# EAGLE design ReDevelo_rev_B (EAGLE 9.6.2)
PC Engine Joypad Breakout Version 1.0
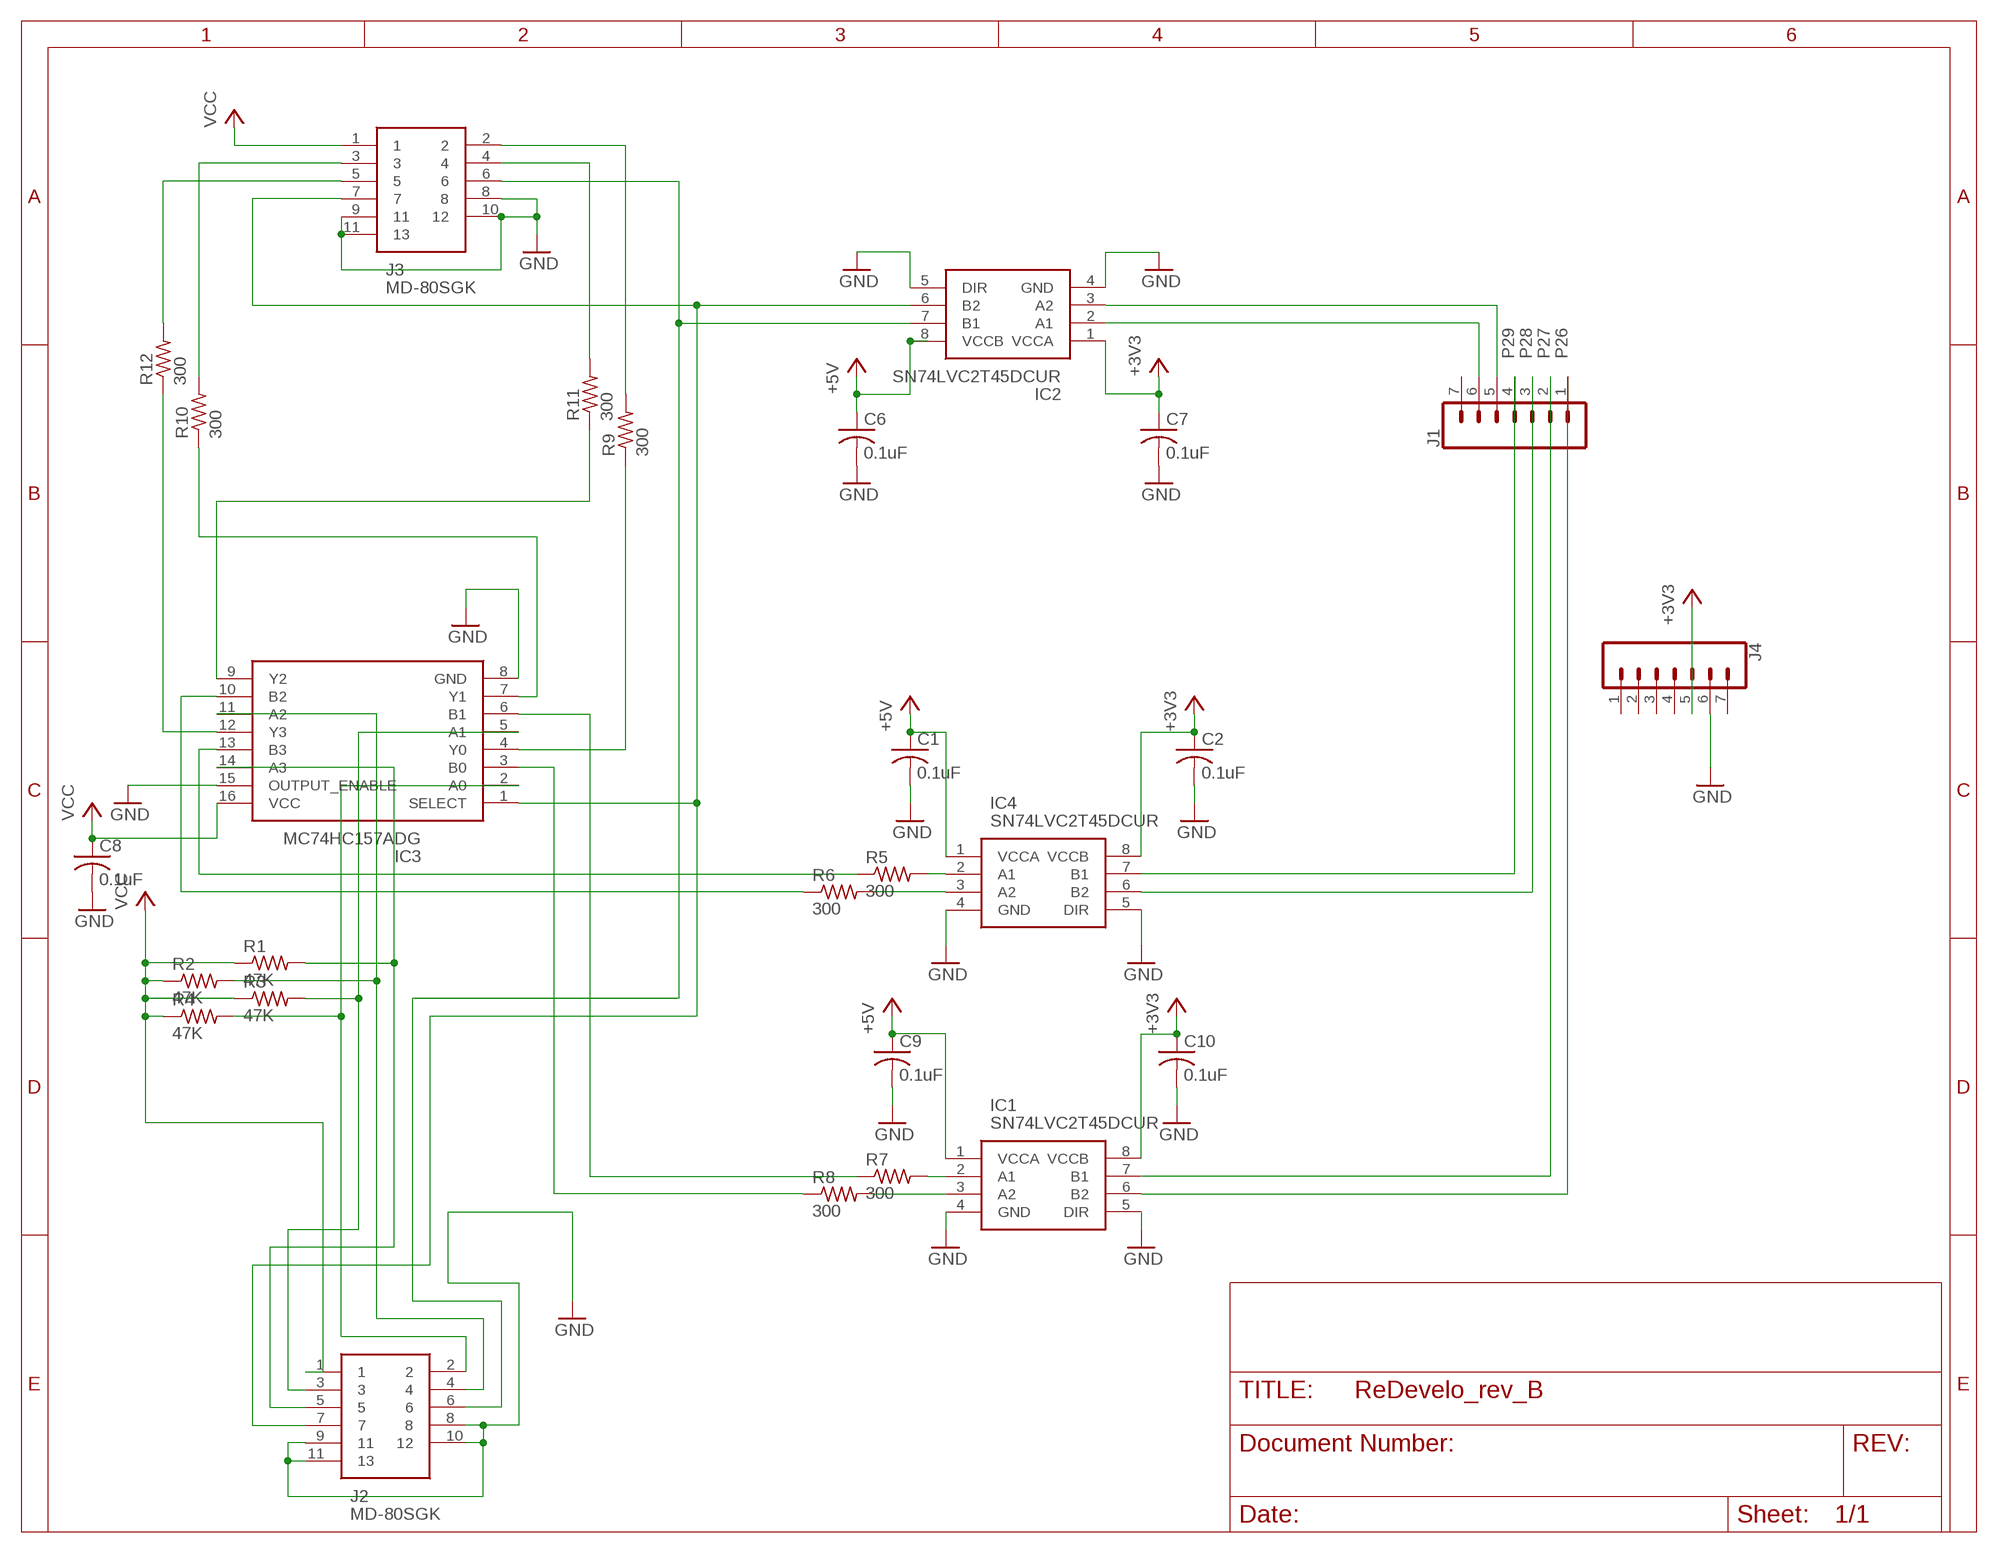
[diagram p0: schematic, sheet 1]

## Parts
C1  0.1uF  C-USC0402  [C0402]
C2  0.1uF  C-USC0402  [C0402]
C6  0.1uF  C-USC0402  [C0402]
C7  0.1uF  C-USC0402  [C0402]
C8  0.1uF  C-USC0402  [C0402]
C9  0.1uF  C-USC0402  [C0402]
C10  0.1uF  C-USC0402  [C0402]
IC1  SN74LVC2T45DCUR  [SOP50P310X90-8N]
IC2  SN74LVC2T45DCUR  [SOP50P310X90-8N]
IC3  MC74HC157ADG  [SOIC127P600X175-16N]
IC4  SN74LVC2T45DCUR  [SOP50P310X90-8N]
J1  CONN_071X07_LONGPADS_OFFSET  [1X07_LONGPADS_OFFSET]
J2  MD-80SGK  [MD80SGK]
J3  MD-80SGK  [MD80SGK]
J4  CONN_071X07_LONGPADS_OFFSET  [1X07_LONGPADS_OFFSET]
R1  47K  R-US_R0402  [R0402]
R2  47K  R-US_R0402  [R0402]
R3  47K  R-US_R0402  [R0402]
R4  47K  R-US_R0402  [R0402]
R5  300  R-US_R0402  [R0402]
R6  300  R-US_R0402  [R0402]
R7  300  R-US_R0402  [R0402]
R8  300  R-US_R0402  [R0402]
R9  300  R-US_R0402  [R0402]
R10  300  R-US_R0402  [R0402]
R11  300  R-US_R0402  [R0402]
R12  300  R-US_R0402  [R0402]

## Nets
+3V3 [power]: C2.1 C7.1 C10.1 IC1.8(VCCB) IC2.1(VCCA) IC4.8(VCCB) J4.5
CLR [signal]: IC2.6(B2) IC3.1(SELECT) J2.7 J3.7
D12: IC2.2(A1) J1.6
D13 [signal]: IC2.3(A2) J1.5
GND: C1.2 C2.2 C6.2 C7.2 C8.2 C9.2 C10.2 IC1.4(GND) IC1.5(DIR) IC2.4(GND) IC2.5(DIR) IC3.8(GND) IC3.15(OUTPUT_ENABLE) IC4.4(GND) IC4.5(DIR) J2.8 J2.9 J2.10 J2.11 J3.8 J3.9 J3.10 J3.11 J4.6
N$2 [signal]: IC3.5(A1) J2.3 R3.2
N$3 [signal]: IC3.2(A0) J2.2 R4.2
N$4 [signal]: IC3.11(A2) J2.4 R2.2
N$5 [signal]: IC3.14(A3) J2.5 R1.2
N$8: IC3.12(Y3) R12.1
N$9: IC3.9(Y2) R11.1
N$10: IC3.13(B3) R5.1
N$11: IC3.7(Y1) R10.1
N$12: IC4.2(A1) R5.2
N$13: IC4.3(A2) R6.2
N$14: IC1.3(A2) R8.2
N$15: IC1.2(A1) R7.2
N$16: IC3.10(B2) R6.1
N$17: IC3.3(B0) R8.1
N$18: IC3.6(B1) R7.1
N$19: J3.2 R9.2
N$20: J3.4 R11.2
N$22: IC3.4(Y0) R9.1
N$23: J3.3 R10.2
N$24: J3.5 R12.2
P26 [signal]: IC1.6(B2) J1.1
P27: IC1.7(B1) J1.2
P28 [signal]: IC4.6(B2) J1.3
P29 [signal]: IC4.7(B1) J1.4
SEL [signal]: IC2.7(B1) J2.6 J3.6
VCC [power]: C1.1 C6.1 C8.1 C9.1 IC1.1(VCCA) IC2.8(VCCB) IC3.16(VCC) IC4.1(VCCA) J2.1 J3.1 R1.1 R2.1 R3.1 R4.1 ; supply symbol labelled +5V
Unconnected: J1.7 J4.1 J4.2 J4.3 J4.4 J4.7

## Library data of the parts
C1 C2 C6-C10 = PC-Engine0402:C-US: CAPACITOR, American symbol
IC1 IC2 IC4 = PC-Engine:SN74LVC2T45DCUR: Texas Instruments SN74LVC2T45DCUR, Voltage Level Translator, Bus Transceiver, 3-State, 1.65 5.5 V, 8-Pin UM Source: Datasheet <http://www.ti.com/lit/gpn/sn74lvc2t45>; ARROW_PART_NUMBER: SN74LVC2T45DCUR; ARROW_PRICE-STOCK: https://www.arrow.com/en/products/sn74lvc2t45dcur/texas-instruments?region=nac; DESCRIPTION: Texas Instruments SN74LVC2T45DCUR, Voltage Level Translator, Bus Transceiver, 3-State, 1.65 5.5 V, 8-Pin UM; HEIGHT: 0.9mm; MANUFACTURER_NAME: Texas Instruments; MANUFACTURER_PART_NUMBER: SN74LVC2T45DCUR; MOUSER_PART_NUMBER: 595-SN74LVC2T45DCUR; MOUSER_PRICE-STOCK: https://www.mouser.co.uk/ProductDetail/Texas-Instruments/SN74LVC2T45DCUR?qs=0smPjiIwnfIdG9vxyJHBdA%3D%3D
IC3 = PC-Engine:MC74HC157ADG: Source: Datasheet <http://www.onsemi.com/pub/Collateral/MC74HC157A-D.PDF>; ALLIED_NUMBER: 70466365; ALLIED_PRICE-STOCK: http://www.alliedelec.com/on-semiconductor-mc74hc157adg/70466365/; HEIGHT: 1.75mm; MANUFACTURER_NAME: ON Semiconductor; MANUFACTURER_PART_NUMBER: MC74HC157ADG; MOUSER_PART_NUMBER: 863-MC74HC157ADG; MOUSER_PRICE-STOCK: https://www.mouser.com/Search/Refine.aspx?Keyword=863-MC74HC157ADG; RS_PART_NUMBER: 8061422P; RS_PRICE-STOCK: http://uk.rs-online.com/web/p/products/8061422P
J1 J4 = SparkFun-Connectors_new:CONN_07: Multi connection point. Often used as Generic Header-pin footprint for 0.1 inch spaced/style header connections On any of the 0.1 inch spaced packages, you can populate with these: Break Away Headers - Straight <https://www.sparkfun.com/products/116> (PRT-00116) Break Away Male Headers - Right Angle <https://www.sparkfun.com/products/553> (PRT-00553) Female Headers <https://www.sparkfun.com/products/115> (PRT-00115) Break Away Headers - Machine Pin <https://www.sparkfun.com/products/117> (PRT-00117) Break Away Female Headers - Swiss Machine Pin <https://www.sparkfun.com/products/743> (PRT-00743) For SCREWTERMINALS and SPRING TERMINALS visit here: Screw Terimnals on SparkFun.com <https://www.sparkfun.com/search/results?term=Screw+Terminals> (5mm/3.5mm/2.54mm spacing) This device is also useful as a general connection point to wire up your design to another part of your project. Our various solder wires solder well into these plated through hole pads. Hook-Up Wire - Assortment (Stranded, 22 AWG) <https://www.sparkfun.com/products/11375> (PRT-11375) Hook-Up Wire - Assortment (Solid Core, 22 AWG) <https://www.sparkfun.com/products/11367> (PRT-11367) View the entire wire category on our website here <https://www.sparkfun.com/categories/141> Special notes: Molex polarized connector foot print use with SKU : PRT-08231 with associated crimp pins and housings. 1MM SMD Version SKU: PRT-10208 NOTES ON THE VARIANTS LOCK and LOCK_LONGPADS... This footprint was designed to help hold the alignment of a through-hole component (i.e. 6-pin header) while soldering it into place. You may notice that each hole has been shifted either up or down by 0.005 of an inch from it's more standard position (which is a perfectly straight line). This slight alteration caused the pins (the squares in the middle) to touch the edges of the holes. Because they are alternating, it causes a "brace" to hold the component in place. 0.005 has proven to be the perfect amount of "off-center" position when using our standard breakaway headers. Although looks a little odd when you look at the bare footprint, once you have a header in there, the alteration is very hard to notice. Also,if you push a header all the way into place, it is covered up entirely on the bottom side.
J2 J3 = SamacSys_Parts:MD-80SGK: Circular DIN Connectors mini-DIN, 8P jack, rt, through hole, full shield Source: Datasheet <https://www.cui.com/product/resource/md-sgk-series.pdf>; DESCRIPTION: Circular DIN Connectors mini-DIN, 8P jack, rt, through hole, full shield; HEIGHT: 13mm; MANUFACTURER_NAME: CUI; MANUFACTURER_PART_NUMBER: MD-80SGK; MOUSER_PART_NUMBER: 490-MD-80SGK; MOUSER_PRICE-STOCK: https://www.mouser.com/Search/Refine.aspx?Keyword=490-MD-80SGK
R1-R12 = PC-Engine0402:R-US_: RESISTOR, American symbol

## Net classes
0 default: width 0.152 mm, drill 0.356 mm, clearance 0.152 mm
1 power: width 0.305 mm, drill 0.356 mm, clearance 0.152 mm
2 signal: width 0.152 mm, drill 0.356 mm, clearance 0.152 mm

## Board
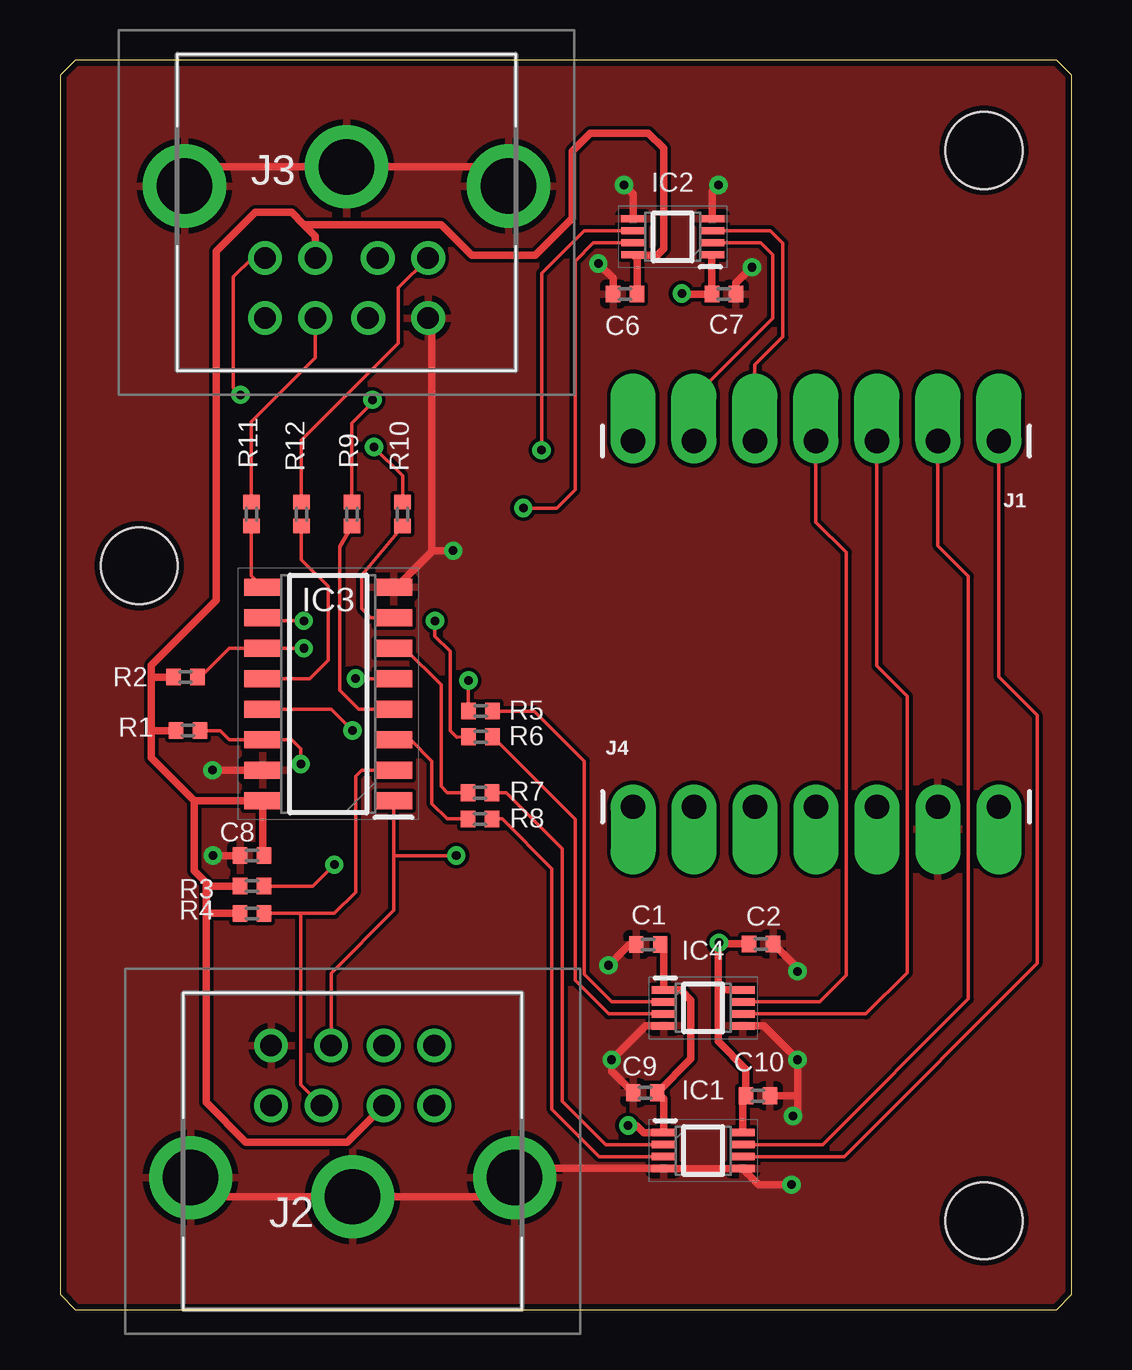
[diagram p1: board, top side]
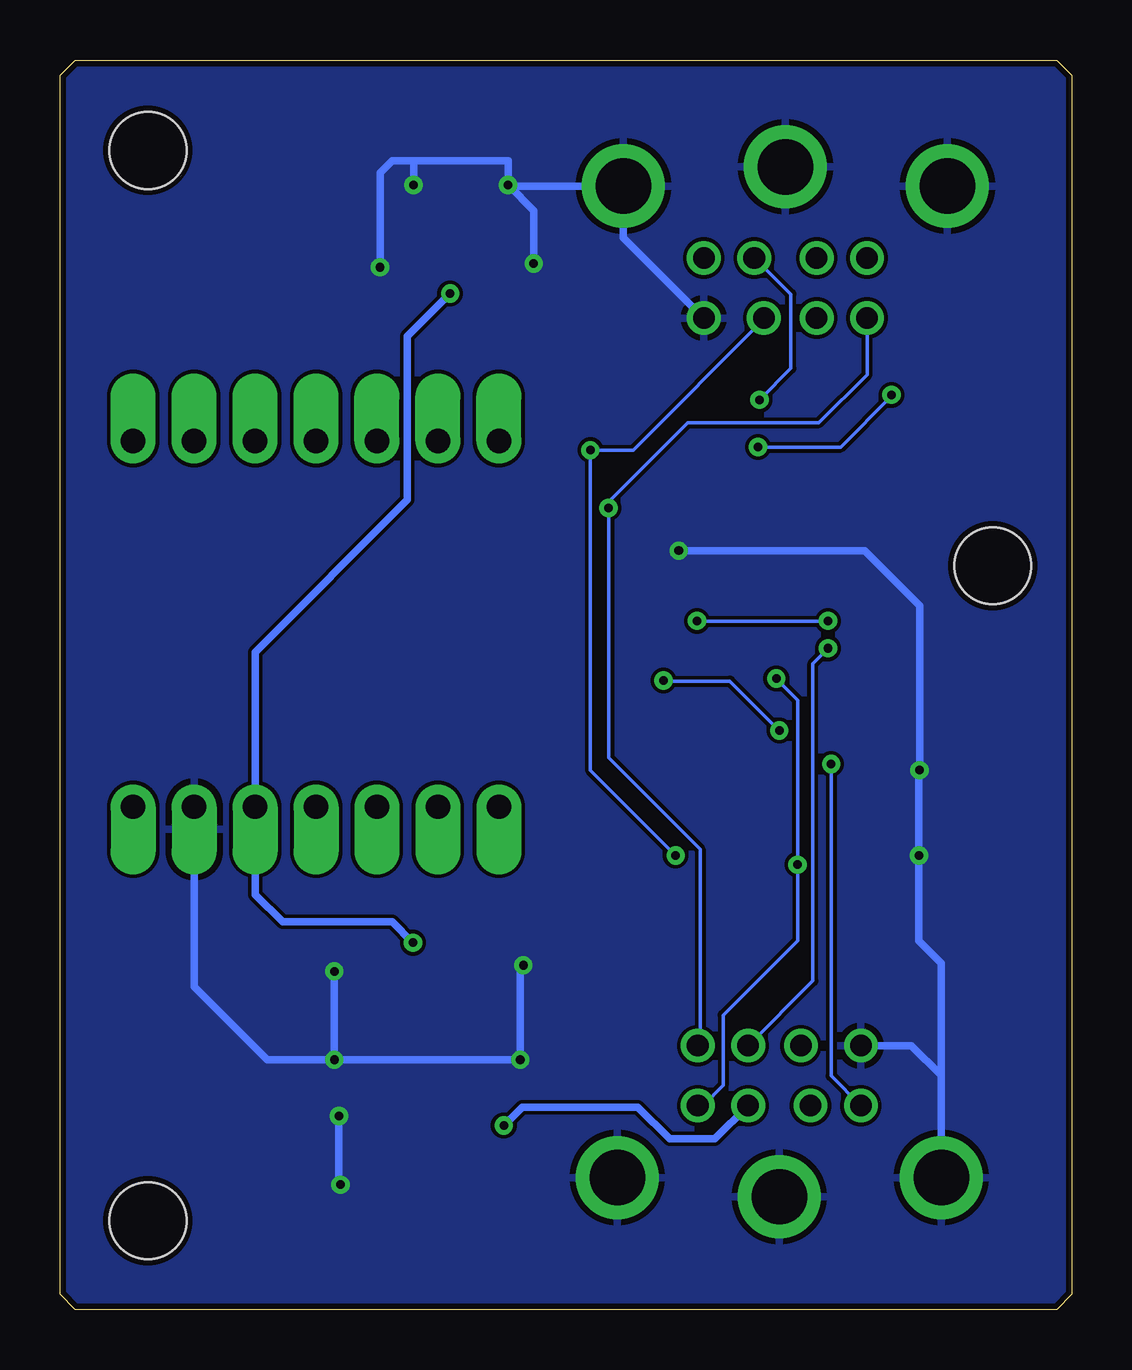
[diagram p2: board, bottom side, seen from below]

Size 42.16 x 52.07 mm. Coordinates in mm from the lower left corner, seen from the top.
Outline: 0.64,0 41.53,0 42.16,0.64 42.16,51.44 41.53,52.07 0.64,52.07 0,51.44 0,0.64 0.64,0
Copper layers (1*16): Top 0.035mm / dielectric 1.5mm / Bottom 0.035mm
Design rules "default *": minimum track width 6mil, minimum drill 0.35mm, track to track 6mil, track to pad 6mil, pad to pad 6mil, via to via 6mil, smd to smd 6mil, copper to edge 10mil, drill to drill 6mil, minimum pad ring 10mil, minimum via ring 8mil, stop-mask expansion 6mil, vias tented up to drill 15mil, thermal gap 10mil
Holes 3.2 mm at 3.3,31 38.5,48.3 38.5,3.7

### Footprints (pad centres in the part's own frame; a part is rotated, then mirrored left to right if it is on the bottom)
C0402 = smd 0.6 x 0.7: 1 -0.5,0; 2 0.5,0
SOP50P310X90-8N = smd 1 x 0.3: 1 -1.65,0.75; 2 -1.65,0.25; 3 -1.65,-0.25; 4 -1.65,-0.75; 5 1.65,-0.75; 6 1.65,-0.25; 7 1.65,0.25; 8 1.65,0.75
SOIC127P600X175-16N = smd 1.55 x 0.7: 1 -2.725,4.445; 2 -2.725,3.175; 3 -2.725,1.905; 4 -2.725,0.635; 5 -2.725,-0.635; 6 -2.725,-1.905; 7 -2.725,-3.175; 8 -2.725,-4.445; 9 2.725,-4.445; 10 2.725,-3.175; 11 2.725,-1.905; 12 2.725,-0.635; 13 2.725,0.635; 14 2.725,1.905; 15 2.725,3.175; 16 2.725,4.445
1X07_LONGPADS_OFFSET = drill 1.016 pad 1.88 offset: 1 0,0; 2 2.54,0; 3 5.08,0; 4 7.62,0; 5 10.16,0; 6 12.7,0; 7 15.24,0
MD80SGK = drill 0.9 pad 1.4: 1 -1.3,-1.9; 2 1.3,-1.9; 3 -3.4,-1.9; 4 -1.3,-4.4; 5 3.4,-1.9; 6 -3.4,-4.4; 7 0.9,-4.4; 8 3.4,-4.4 | drill 2.309 pad 3.463: 9 0,1.9; 10 -6.75,1.1; 11 6.75,1.1
R0402 = smd 0.6 x 0.7: 1 -0.5,0; 2 0.5,0

### Placement (x,y rotation side)
C1  24.51,15.21 180 top
C2  29.21,15.24 0 top
C6  23.55,42.32 180 top
C7  27.66,42.32 0 top
C8  8,18.92 180 top
C9  24.38,9.04 180 top
C10  29.08,8.92 0 top
IC1  26.8,6.63 0 top
IC2  25.53,44.7 180 top
IC3  11.18,25.65 180 top
IC4  26.8,12.57 0 top
J1  39.12,36.2 180 top
J2  12.19,6.6 180 top
J3  11.94,45.72 0 top
J4  23.88,20.95 0 top
R1  5.33,24.13 0 top
R2  5.23,26.36 0 top
R3  8,17.65 0 top
R4  8,16.51 0 top
R5  17.53,24.94 0 top
R6  17.53,23.88 0 top
R7  17.5,21.54 0 top
R8  17.5,20.45 0 top
R9  12.17,33.15 90 top
R10  14.27,33.15 90 top
R11  7.98,33.15 90 top
R12  10.06,33.15 90 top

### Tracks (layer width: path | path; a pad name or v marks a point on that pad's centre or on a via)
+3V3  (via drill 0.36)
  Top 0.305: 27.43,13.34 27.43,11.18 28.58,10.03 C10.1 28.45,8.78 IC1.8 | 27.43,13.34 28.43,13.34 IC4.8 | 27.43,13.34 27.43,15.27 v27.46,15.29 27.51,15.24 C2.1 | IC2.1 27.16,43.94 C7.1 25.93,42.32 v25.91,42.34
  Bottom 0.305: v27.46,15.29 28.32,16.15 32.89,16.15 34.04,17.3 J4.5 34.04,27.4 27.69,33.75 27.69,40.56 v25.91,42.34
CLR  (via drill 0.36)
  Top 0.152: v20.07,35.81 20.07,43.18 21.84,44.95 IC2.6 | J2.7 11.29,14.03 13.9,16.64 13.9,18.92 | 13.9,18.92 IC3.1 | v16.51,18.92 13.9,18.92
  Bottom 0.152: J3.7 12.84,41.26 18.29,35.81 v20.07,35.81 20.07,22.48 v16.51,18.92
D12
  Top 0.152: IC2.2 29.21,44.45 29.7,43.95 29.7,41.31 26.42,38.02 J1.6
D13
  Top 0.152: IC2.3 29.59,44.96 30.12,44.42 30.12,40.54 28.96,39.37 J1.5
GND  (via drill 0.36)
  Top 0.305: J2.11 6.24,4.7 J2.9 18.14,4.7 J2.10 19.32,5.88 IC1.4 IC1.5 29.12,5.21 v30.48,5.21 | J3.10 5.99,47.62 J3.9 17.89,47.62 J3.11 | IC3.8 14.02,30.1 15.49,31.57 | J3.8 15.49,41.17 15.49,31.57 | v23.5,46.86 23.88,46.48 IC2.5 | IC2.4 27.18,46.61 v27.43,46.86 | IC4.5 29.32,11.82 v30.73,10.41 30.73,8.81 | IC4.4 24.4,11.82 v22.99,10.41 22.99,9.94 C9.2 | v6.38,18.92 C8.2 | v6.35,22.48 IC3.15 | 30.73,8.81 30.73,8.26 v30.54,8.06 | C10.2 30.63,8.91 30.73,8.81 | C2.2 30.73,14.22 v30.73,14.1 | v22.86,14.35 23.72,15.21 C1.2 | C7.2 28.16,42.77 v28.83,43.43 | v22.43,43.59 23.05,42.97 C6.2 | v16.38,31.62 15.54,31.62 15.49,31.57
  Bottom 0.305: J3.8 18.69,44.67 J3.11 23.45,46.82 v23.5,46.86 | 27.43,47.88 23.5,47.88 v23.5,46.86 | 27.43,47.88 28.32,47.88 28.83,47.37 v28.83,43.43 | 27.43,47.88 v27.43,46.86 | v30.73,14.1 v30.73,10.41 | v30.54,8.06 30.54,5.27 v30.48,5.21 | v22.86,14.35 22.99,14.22 v22.99,10.41 v30.73,10.41 | J2.8 6.69,11 5.44,9.76 | J2.11 5.44,9.76 | 5.44,9.76 5.44,14.43 6.38,15.37 v6.38,18.92 6.38,22.45 v6.35,22.48 6.35,29.34 8.64,31.62 v16.38,31.62 | v23.5,46.86 22.43,45.8 v22.43,43.59 | v30.73,10.41 33.53,10.41 36.58,13.46 J4.6
  pour Bottom: -0.38,52.83 43.05,52.83 43.05,-0.38 -0.38,-0.38
  pour Top: -1.02,-0.25 -1.02,53.09 43.56,53.09 43.56,-0.51 -0.76,-0.51
N$2  (via drill 0.36)
  Top 0.152: R3.2 10.54,17.65 v11.43,18.54 | v12.32,26.3 12.33,26.29 IC3.5
  Bottom 0.152: J2.3 15.37,8.5 14.53,9.35 14.53,12.27 11.43,15.37 v11.43,18.54 11.43,25.4 v12.32,26.29 v12.32,26.3
N$3
  Top 0.152: J2.2 10.03,9.36 10.03,16.51 | IC3.2 12.58,22.48 12.32,22.22 12.32,17.4 11.43,16.51 11.05,16.51 10.03,16.51 | R4.2 10.03,16.51
N$4  (via drill 0.36)
  Top 0.152: R2.2 5.85,26.36 7.05,27.56 IC3.11 v10.16,27.56
  Bottom 0.152: J2.4 10.79,13.7 10.79,26.92 v10.16,27.56
N$5  (via drill 0.36)
  Top 0.152: R1.2 6.67,24.13 7.05,23.75 IC3.14 9.65,23.75 10.03,23.37 v10.03,22.73
  Bottom 0.152: J2.5 10.03,9.74 v10.03,22.73
N$8
  Top 0.152: IC3.12 10.41,26.29 11.18,27.05 11.18,30.14 10.06,31.26 R12.1
N$9
  Top 0.152: IC3.9 7.98,30.57 R11.1
N$10  (via drill 0.36)
  Top 0.152: IC3.13 11.3,25.02 v12.19,24.13 | R5.1 17.02,24.95 v17.02,26.21
  Bottom 0.152: v12.19,24.13 14.25,26.19 16.99,26.19 v17.02,26.21
N$11
  Top 0.152: IC3.7 12.95,28.83 12.57,29.21 12.57,30.59 R10.1
N$12
  Top 0.152: R5.2 19.76,24.94 21.84,22.86 21.84,13.97 22.99,12.82 IC4.2
N$13
  Top 0.152: R6.2 21.46,20.44 21.46,13.72 22.86,12.32 IC4.3
N$14
  Top 0.152: IC1.3 22.48,6.38 20.5,8.36 20.5,18.38 18.43,20.45 R8.2
N$15
  Top 0.152: IC1.2 22.74,6.88 20.93,8.69 20.93,19.2 18.59,21.54 R7.2
N$16  (via drill 0.36)
  Top 0.152: v15.62,28.7 15.62,28.07 16.26,27.43 16.26,24.13 16.54,23.85 R6.1 | v10.16,28.7 8.58,28.7 IC3.10
  Bottom 0.152: v15.62,28.7 15.6,28.68 10.19,28.68 v10.16,28.7
N$17
  Top 0.152: IC3.3 14.61,23.75 15.49,22.86 15.49,21.08 16.13,20.45 R8.1
N$18
  Top 0.152: R7.1 16.14,21.54 15.88,21.8 15.88,26.04 14.35,27.56 IC3.6
N$19  (via drill 0.36)
  Top 0.152: R9.2 12.17,36.93 13.08,37.85 v13.02,37.91
  Bottom 0.152: v13.02,37.91 11.71,39.22 11.71,42.32 13.21,43.82 J3.2
N$20
  Top 0.152: R11.2 7.98,36.99 10.64,39.66 J3.4
N$22
  Top 0.152: R9.1 11.66,31.79 11.66,25.81 12.45,25.02 IC3.4
N$23  (via drill 0.36)
  Top 0.152: J3.3 8.01,43.82 7.22,43.04 7.22,38.42 v7.52,38.12 | R10.2 14.28,34.75 v13.08,35.94
  Bottom 0.152: v13.08,35.94 9.64,35.94 7.52,38.06 v7.52,38.12
N$24
  Top 0.152: J3.5 14.1,42.58 14.1,40.26 10.06,36.22 R12.2
P26
  Top 0.152: IC1.6 32.67,6.38 40.72,14.43 40.72,24.77 39.12,26.37 J1.1
P27
  Top 0.152: IC1.7 31.77,6.88 37.85,12.95 37.85,30.56 36.58,31.83 J1.2
P28
  Top 0.152: J1.3 34.04,26.82 35.31,25.55 35.31,14.05 33.58,12.32 IC4.6
P29
  Top 0.152: IC4.7 31.65,12.82 32.76,13.94 32.76,31.55 31.5,32.82 J1.4
SEL  (via drill 0.36)
  Top 0.152: IC2.7 22.23,44.45 21.46,43.69 21.46,34.16 20.7,33.4 v19.3,33.4
  Bottom 0.152: J3.6 8.54,38.96 10.54,36.96 16,36.96 19.3,33.66 v19.3,33.4 19.3,22.99 15.49,19.18 15.49,11.1 J2.6
VCC  (via drill 0.36)
  Top 0.305: 3.81,24.13 3.81,22.99 5.59,21.21 | 5.59,21.21 IC3.16 8.45,18.95 C8.1 | 10.16,45.21 10.64,44.73 J3.1 | 10.16,45.21 9.65,45.72 8.13,45.72 6.51,44.1 6.51,29.55 3.81,26.86 3.81,26.36 | 10.16,45.21 15.88,45.21 17.15,43.94 19.81,43.94 21.34,45.47 21.34,48.26 22.1,49.02 24.51,49.02 25.15,48.39 25.15,44.2 24.89,43.94 IC2.8 24.05,43.78 C6.1 | J2.1 11.97,6.99 7.75,6.99 6.1,8.64 6.1,16.51 | 3.81,24.13 3.81,26.36 | R2.1 3.81,26.36 | 6.1,16.51 6.1,17.65 | 5.59,21.21 5.59,18.29 6.1,17.78 6.1,17.65 | C1.1 25.15,15.08 IC4.1 25.86,13.32 26.29,12.89 26.29,10.45 C9.1 25.15,8.78 IC1.1 24.32,7.38 24.03,7.67 v23.67,7.67 | R3.1 6.1,17.65 | R4.1 6.1,16.51 | R1.1 3.81,24.13
  Bottom 0.305: J2.1 14.88,7.11 16.76,7.11 18.09,8.43 22.91,8.43 v23.67,7.67

### Text on the board
tValues: JLCJLCJLCJLC | ReDevelo MCU, rev. B | (C)2022 David Shadoff